# Altium project cSLIM-shield.PrjPcb (part 2 of 2)

## Sheet cSLIM-SA_GPS.SchDoc: cSLIM v1 - GNSS
size A4; SheetNumber: 10; SheetTotal: 12
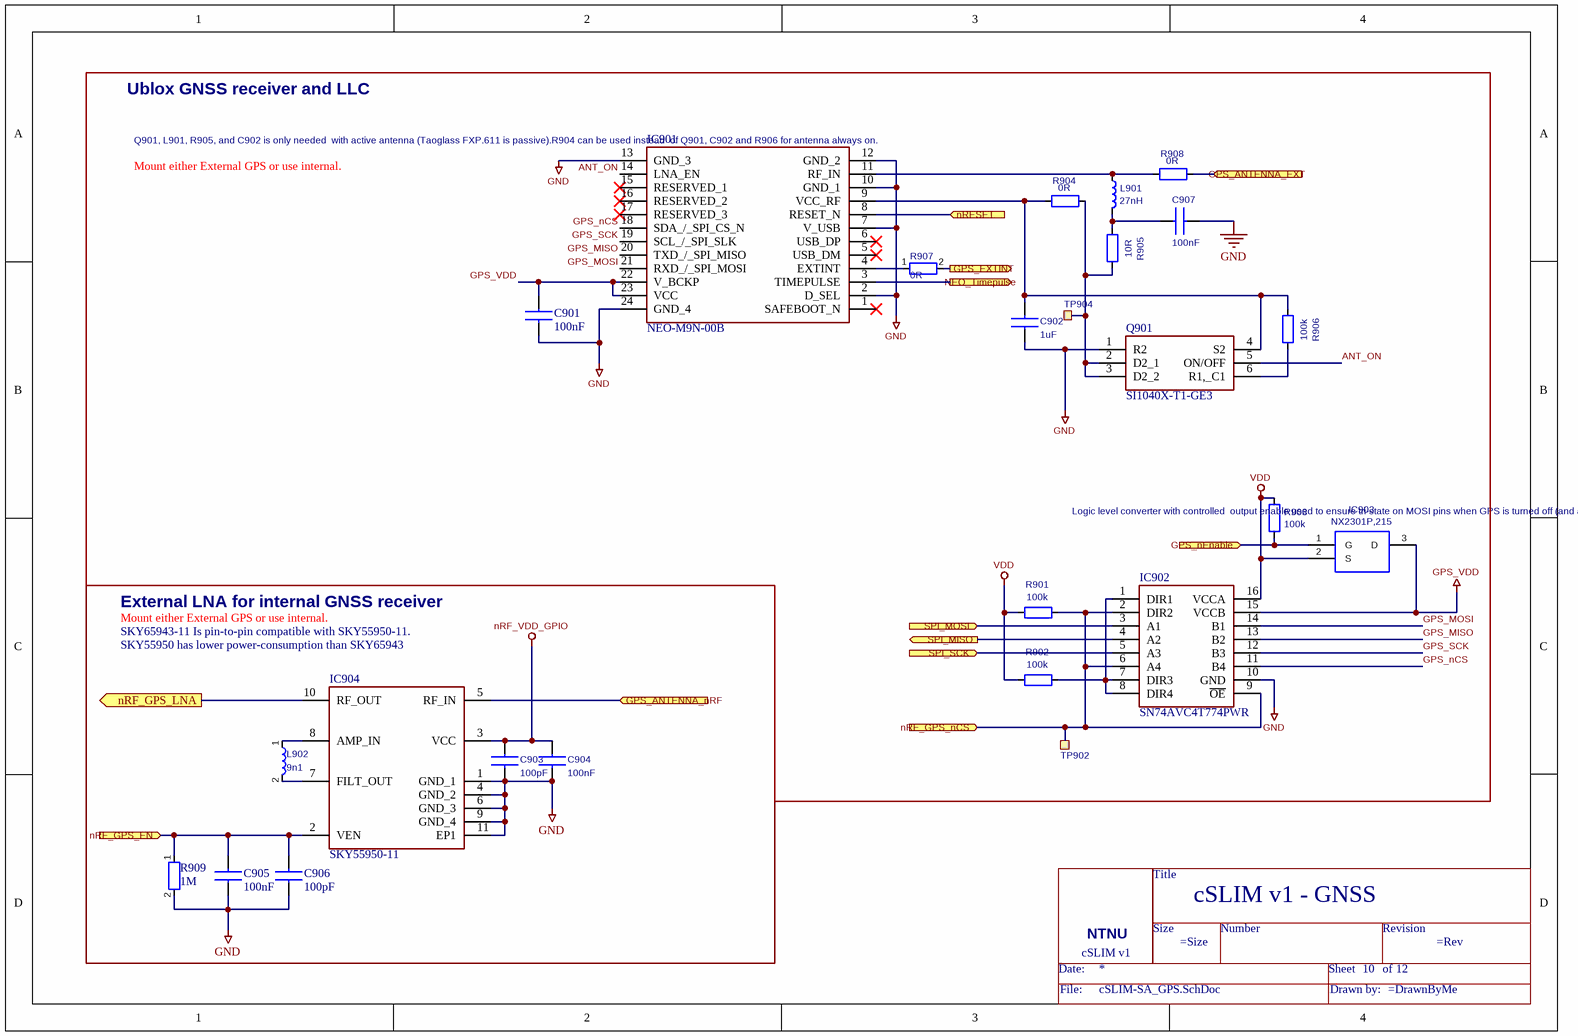
[diagram p8: cSLIM-SA_GPS.SchDoc]

### Parts
(Parts that share a designator on the sheet are numbered #1, #2 ... from top to bottom, then left to right.)
=DocumentName#3  Title_block  (value not drawn)  (no BOM)
C901  100nF  [CAPC1608X90N]
C902  1uF  [CAPC1608X90N]
C903  100pF  [CAPC1608X90N]
C904  100nF  [CAPC1608X90N]
C905  100nF  [CAPC1608X90N]
C906  100pF  [CAPC1608X90N]
C907  100nF  [CAPC1608X90N]
IC901  NEO-M9N-00B  [NEOM9N00B]
IC902  SN74AVC4T774PWR  [SOP65P640X120-16N]
IC903  NX2301P,215  [SOT95P230X110-3N]
IC904  SKY55950-11  [SKY6594311]
L901  27nH  [L-1608]
L902  9n1  [LQW18AS10NG0CD]
Q901  SI1040X-T1-GE3  [SOTFL50P160X60-6N]
R901  100k  [RESC1608X55N]
R902  100k  [RESC1608X55N]
R903  100k  [RESC1608X55N]
R904  0R  [RESC1608X55N]
R905  10R  [RESC1608X55N]
R906  100k  [RESC1608X55N]
R907  0R  [RESC1608X55N]
R908  0R  [RESC1608X55N]
R909  1M  [RESC1608X55N]
TP902  (no value)  [TP_SMD_Ø1.0mm]  (no BOM)
TP904  (no value)  [TP_SMD_Ø1.0mm]  (no BOM)

### Blocks framed on the sheet
Ublox GNSS receiver and LLC: C901 C902 C907 IC901-IC903 L901 Q901 R901-R908 TP902 TP904
External LNA for internal GNSS receiver: C903-C906 IC904 L902 R909

### Ports
GPS_ANTENNA_EXT (in), GPS_ANTENNA_nRF (in), GPS_EXTINT (out), GPS_nEnable (in), NEO_Timepulse (out), nRESET (in), nRF_GPS_EN (in), nRF_GPS_LNA (out), nRF_GPS_nCS (in), SPI_MISO (out), SPI_MOSI (in), SPI_SCK (in)

### Nets
GND: C901.2 C902.2 C903.1 C904.1 C905.1 C906.1 C907.2 IC901.2(D_SEL) IC901.7(V_USB) IC901.10(GND_1) IC901.12(GND_2) IC901.13(GND_3) IC901.24(GND_4) IC902.10(GND) IC904.1(GND_1) IC904.4(GND_2) IC904.6(GND_3) IC904.9(GND_4) IC904.11(EP1) Q901.1(R2) R909.2
GPS_VDD: C901.1 IC901.22(V_BCKP) IC901.23(VCC) IC902.15(VCCB) IC903.3(D)
nRF_VDD_GPIO: C903.2 C904.2 IC904.3(VCC)
VDD: IC902.16(VCCA) IC903.2(S) R901.2 R902.2 R903.2
ANT_ON: IC901.14(LNA_EN) Q901.5(ON/OFF)
GPS_ANTENNA_EXT: R908.1 ; port GPS_ANTENNA_EXT
GPS_ANTENNA_nRF: IC904.5(RF_IN) ; port GPS_ANTENNA_nRF
GPS_EXTINT: R907.2 ; port GPS_EXTINT
GPS_MISO: IC901.20(TXD_/_SPI_MISO) IC902.13(B2)
GPS_MOSI: IC901.21(RXD_/_SPI_MOSI) IC902.14(B1)
GPS_nCS: IC901.18(SDA_/_SPI_CS_N) IC902.11(B4)
GPS_nEnable: IC903.1(G) R903.1 ; port GPS_nEnable
GPS_SCK: IC901.19(SCL_/_SPI_SLK) IC902.12(B3)
NEO_Timepulse: IC901.3(TIMEPULSE) ; port NEO_Timepulse
nRESET: IC901.8(RESET_N) ; port nRESET
nRF_GPS_EN: C905.2 C906.2 IC904.2(VEN) R909.1 ; port nRF_GPS_EN
nRF_GPS_LNA: IC904.10(RF_OUT) ; port nRF_GPS_LNA
nRF_GPS_nCS: IC902.2(DIR2) IC902.6(A4) IC902.9(~{OE}) R901.1 TP902.1 ; port nRF_GPS_nCS
SPI_MISO: IC902.4(A2) ; port SPI_MISO
SPI_MOSI: IC902.3(A1) ; port SPI_MOSI
SPI_SCK: IC902.5(A3) ; port SPI_SCK
NetC902_1: C902.1 IC901.9(VCC_RF) Q901.4(S2) R904.2 R906.2
NetC907_1: C907.1 L901.2 R905.2
NetIC901_4: IC901.4(EXTINT) R907.1
NetIC901_11: IC901.11(RF_IN) L901.1 R908.2
NetIC902_1: IC902.1(DIR1) IC902.7(DIR3) IC902.8(DIR4) R902.1
NetIC904_7: IC904.7(FILT_OUT) L902.2
NetIC904_8: IC904.8(AMP_IN) L902.1
NetQ901_2: Q901.2(D2_1) Q901.3(D2_2) R904.1 R905.1 TP904.1
NetQ901_6: Q901.6(R1,_C1) R906.1

Not connected (* = marked no-connect by the designer): IC901 1(SAFEBOOT_N)* 5(USB_DM)* 6(USB_DP)* 15(RESERVED_1)* 16(RESERVED_2)* 17(RESERVED_3)*

### Notes on the sheet
- (near IC901) Q901, L901, R905, and C902 is only needed
  with active antenna (Taoglass FXP.611 is passive).R904 can be used instead
  of Q901, C902 and R906 for antenna always on.
- Mount either External GPS or use internal.
- (near R903) Logic level converter with controlled
  output enable used to ensure tri-state
  on MOSI pins when GPS is turned off
  (and avoid waking up GPS on activity
  on MOSI line as describe by Rundhovde)
- SKY65943-11 Is pin-to-pin compatible with SKY55950-11.
- (near IC904) SKY55950 has lower power-consumption than SKY65943
- 1
- 2
- 3
- 4
- 5
- 6
- A
- B
- C
- Eivind Jølsgard
- D
- Title: cSLIM External GPS
- File: cSLIM_GPS.sch
- Sheet: /
- NTNU
- KiCad E.D.A.  kicad (5.1.4)-1
- Size: A4
- Date: 2021-03-31
- Rev: v1
- Id: 9/11
- (in symbol Title_block) Title; Size; Number; Revision; NTNU; cSLIM v1; Date:; Sheet; of; File:; Drawn by:

### Library data of the parts
C901-C907 = C: Capacitor; Manufacturer_Name: AVX; Manufacturer_Part_Number: 06033G104ZAT2A; Datasheet Link: http://www.mouser.com/catalog/supplier/library/pdf/AVXSurfaceMountCeramic.pdf; Height: 0.9mm; Mouser Part Number: 581-06033G104Z; Mouser Price/Stock: https://www.mouser.co.uk/ProductDetail/AVX/06033G104ZAT2A?qs=NXubJDmysXJMPmHfVo6Z%252BA%3D%3D; Arrow Part Number: 06033G104ZAT2A; Arrow Price/Stock: https://www.arrow.com/en/products/06033g104zat2a/avx?region=nac
IC901 = NEO-M9N-00B: Integrated Circuit; Manufacturer_Name: U-Blox; Datasheet Link: https://www.u-blox.com/sites/default/files/NEO-M9N_DataSheet_%28UBX-19014285%29.pdf; Height: 2.6mm; Manufacturer_Part_Number: NEO-M9N-00B; Mouser Part Number: 377-NEO-M9N-00B; Mouser Price/Stock: https://www.mouser.co.uk/ProductDetail/u-blox/NEO-M9N-00B?qs=DPoM0jnrROVeJ6BHpcwcjw%3D%3D
IC902 = SN74AVC4T774PWR: Integrated Circuit; Manufacturer_Name: Texas Instruments; Datasheet Link: http://www.ti.com/lit/gpn/sn74avc4t774; Height: 1.2mm; Manufacturer_Part_Number: SN74AVC4T774PWR; Mouser Part Number: 595-SN74AVC4T774PWR; Mouser Price/Stock: https://www.mouser.co.uk/ProductDetail/Texas-Instruments/SN74AVC4T774PWR?qs=WxL8HmPi5r562Eu%2F2kE2LA%3D%3D; Arrow Part Number: SN74AVC4T774PWR; Arrow Price/Stock: https://www.arrow.com/en/products/sn74avc4t774pwr/texas-instruments?region=nac
IC903 = NX2301P,215: Manufacturer_Name: Nexperia; Height: 1.1; Mouser Part Number: 771-NX2301P215; Mouser Price/Stock: https://www.mouser.co.uk/ProductDetail/Nexperia/NX2301P215?qs=A1cBxND5mHKs%252BLrxCDENxw%3D%3D; Manufacturer_Part_Number: NX2301P,215; Value: NX2301P,215; Footprint: SamacSys:SOT95P230X110-3N
IC904 = SKY65943-11: Integrated Circuit; Manufacturer_Name: Skyworks; Datasheet Link: https://datasheet.datasheetarchive.com/originals/distributors/DKDS41/DSANUWW0028396.pdf; Height: 0.7mm; Manufacturer_Part_Number: SKY65943-11; Mouser Part Number: 873-SKY65943-11; Mouser Price/Stock: https://www.mouser.co.uk/ProductDetail/Skyworks-Solutions-Inc/SKY65943-11?qs=w%2Fv1CP2dgqpnHmrnB1Mkow%3D%3D
L901 = L
L902 = L_1
Q901 = SI1040X-T1-GE3: MOSFET (N-Channel); Manufacturer_Name: Vishay; Datasheet Link: https://www.vishay.com/docs/71809/si1040x.pdf; Height: 0.6mm; Manufacturer_Part_Number: SI1040X-T1-GE3; Mouser Part Number: 781-SI1040X-T1-GE3; Mouser Price/Stock: https://www.mouser.co.uk/ProductDetail/Vishay-Semiconductors/SI1040X-T1-GE3?qs=tWM4QuTcS4WRJw%2FdSgdX6Q%3D%3D; Arrow Part Number: SI1040X-T1-GE3; Arrow Price/Stock: https://www.arrow.com/en/products/si1040x-t1-ge3/vishay
R901-R909 = R
  R901-R903 R906: Value: 100k
  R904 R908: Value: 0R
  R905: Value: 10R
TP902 TP904 = TP

## Sheet cSLIM-SA_FRAM.SchDoc
size 297 x 210 mm; SheetNumber: 11
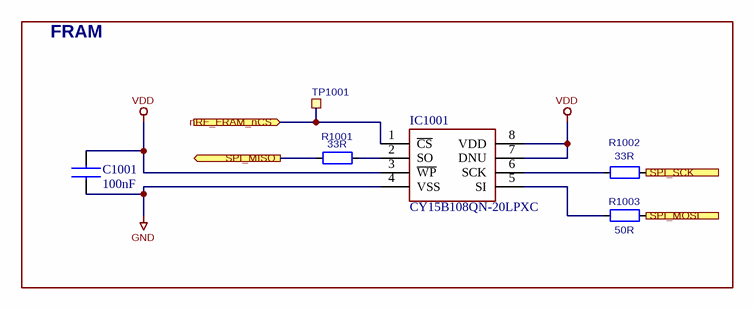
[diagram p9: cSLIM-SA_FRAM.SchDoc]

### Parts
C1001  100nF  [CAPC1608X90N]
IC1001  CY15B108QN-20LPXC  [SON65P323X328X55-8N]
R1001  33R  [RESC1608X55N]
R1002  33R  [RESC1608X55N]
R1003  50R  [RESC1608X55N]
TP1001  (no value)  [TP_SMD_Ø1.0mm]  (no BOM)

### Blocks framed on the sheet
FRAM: C1001 IC1001 R1001-R1003 TP1001

### Ports
nRF_FRAM_nCS (in), SPI_MISO (out), SPI_MOSI (in), SPI_SCK (in)

### Nets
GND: C1001.2 IC1001.4(VSS)
VDD: C1001.1 IC1001.3(~{WP}) IC1001.7(DNU) IC1001.8(VDD)
nRF_FRAM_nCS: IC1001.1(~{CS}) TP1001.1 ; port nRF_FRAM_nCS
SPI_MISO: R1001.1 ; port SPI_MISO
SPI_MOSI: R1003.1 ; port SPI_MOSI
SPI_SCK: R1002.1 ; port SPI_SCK
NetIC1001_2: IC1001.2(SO) R1001.2
NetIC1001_5: IC1001.5(SI) R1003.2
NetIC1001_6: IC1001.6(SCK) R1002.2

### Notes on the sheet
- 1
- 2
- 3
- 4
- 5
- 6
- A
- B
- C
- Eivind Jølsgard
- D
- Title: cSLIM FRAM
- File: cSLIM_FRAM.sch
- Sheet: /
- NTNU
- KiCad E.D.A.  kicad (5.1.4)-1
- Size: A4
- Date: 2021-03-31
- Rev: v1
- Id: 10/11

### Library data of the parts
C1001 = C: as C901 on sheet cSLIM-SA_GPS; Datasheet Link: http://www.mouser.com/catalog/supplier/library/pdf/AVXSurfaceMountCeramic.pdf; Height: 0.9mm; Mouser Part Number: 581-06033G104Z; Mouser Price/Stock: https://www.mouser.co.uk/ProductDetail/AVX/06033G104ZAT2A?qs=NXubJDmysXJMPmHfVo6Z%252BA%3D%3D; Arrow Part Number: 06033G104ZAT2A; Arrow Price/Stock: https://www.arrow.com/en/products/06033g104zat2a/avx?region=nac
IC1001 = CY15B108QN-20LPXC: Integrated Circuit; Manufacturer_Name: Cypress Semiconductor; Datasheet Link: https://www.arrow.com/en/products/cy15b108qn-20lpxc/cypress-semiconductor; Height: 0.55mm; Manufacturer_Part_Number: CY15B108QN-20LPXC; Mouser Part Number: 727-CY15B108QN20LPXC; Mouser Price/Stock: https://www.mouser.co.uk/ProductDetail/Cypress-Semiconductor/CY15B108QN-20LPXC?qs=P1JMDcb91o5srFPNWUxrEA%3D%3D; Arrow Part Number: CY15B108QN-20LPXC; Arrow Price/Stock: https://www.arrow.com/en/products/cy15b108qn-20lpxc/cypress-semiconductor?region=nac
R1001-R1003 = R
  R1001 R1002: Value: 33R
  R1003: Value: 50R
TP1001 = TP

## Sheet cSLIM-SA_RTC.SchDoc: cSLIM v1 - RTC
size A4; SheetNumber: 12; SheetTotal: 12
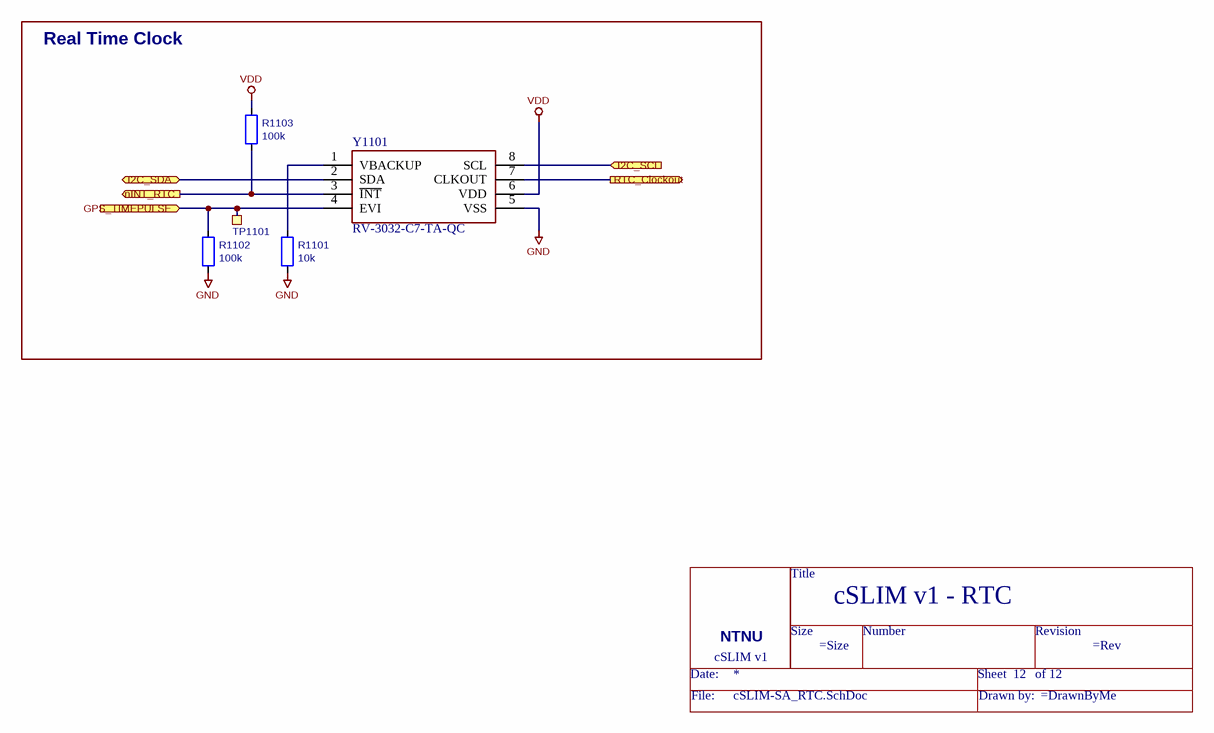
[diagram p10: cSLIM-SA_RTC.SchDoc]

### Parts
(Parts that share a designator on the sheet are numbered #1, #2 ... from top to bottom, then left to right.)
=DocumentName#4  Title_block  (value not drawn)  (no BOM)
R1101  10k  [RESC1608X55N]
R1102  100k  [RESC1608X55N]
R1103  100k  [RESC1608X55N]
TP1101  (no value)  [TP_SMD_Ø1.0mm]  (no BOM)
Y1101  RV-3032-C7-TA-QC  [RV3032C7TAQA]

### Blocks framed on the sheet
Real Time Clock: R1101-R1103 TP1101 Y1101

### Ports
GPS_TIMEPULSE (in), I2C_SCL (in), I2C_SDA (bidir), nINT_RTC (out), RTC_Clockout (out)

### Nets
GND: R1101.2 R1102.1 Y1101.5(VSS)
VDD: R1103.2 Y1101.6(VDD)
GPS_TIMEPULSE: R1102.2 TP1101.1 Y1101.4(EVI) ; port GPS_TIMEPULSE
I2C_SCL: Y1101.8(SCL) ; port I2C_SCL
I2C_SDA: Y1101.2(SDA) ; port I2C_SDA
nINT_RTC: R1103.1 Y1101.3(~{INT}) ; port nINT_RTC
RTC_Clockout: Y1101.7(CLKOUT) ; port RTC_Clockout
NetR1101_1: R1101.1 Y1101.1(VBACKUP)

### Notes on the sheet
- 1
- 2
- 3
- 4
- 5
- 6
- A
- B
- C
- Eivind Jølsgard
- D
- Title: cSLIM RTC
- File: cSLIM_RTC.sch
- Sheet: /
- NTNU
- KiCad E.D.A.  kicad (5.1.4)-1
- Size: A4
- Date: 2021-03-31
- Rev: v1
- Id: 11/11
- (in symbol Title_block) Title; Size; Number; Revision; NTNU; cSLIM v1; Date:; Sheet; of; File:; Drawn by:

### Library data of the parts
R1101-R1103 = R
  R1101: Value: 10k
  R1102 R1103: Value: 100k
TP1101 = TP
Y1101 = RV-3032-C7-TA-QC: Integrated Circuit; Manufacturer_Name: Micro Crystal AG; Datasheet Link: https://www.microcrystal.com/fileadmin/Media/Products/RTC/Datasheet/RV-3032-C7.pdf; Height: 0.8mm; Manufacturer_Part_Number: RV-3032-C7-TA-QC

## Sheet cSLIM-SA_nRF9160.SchDoc: cSLIM v1 - nRF9160
size A3; SheetNumber: 2; SheetTotal: 12; Size: A3
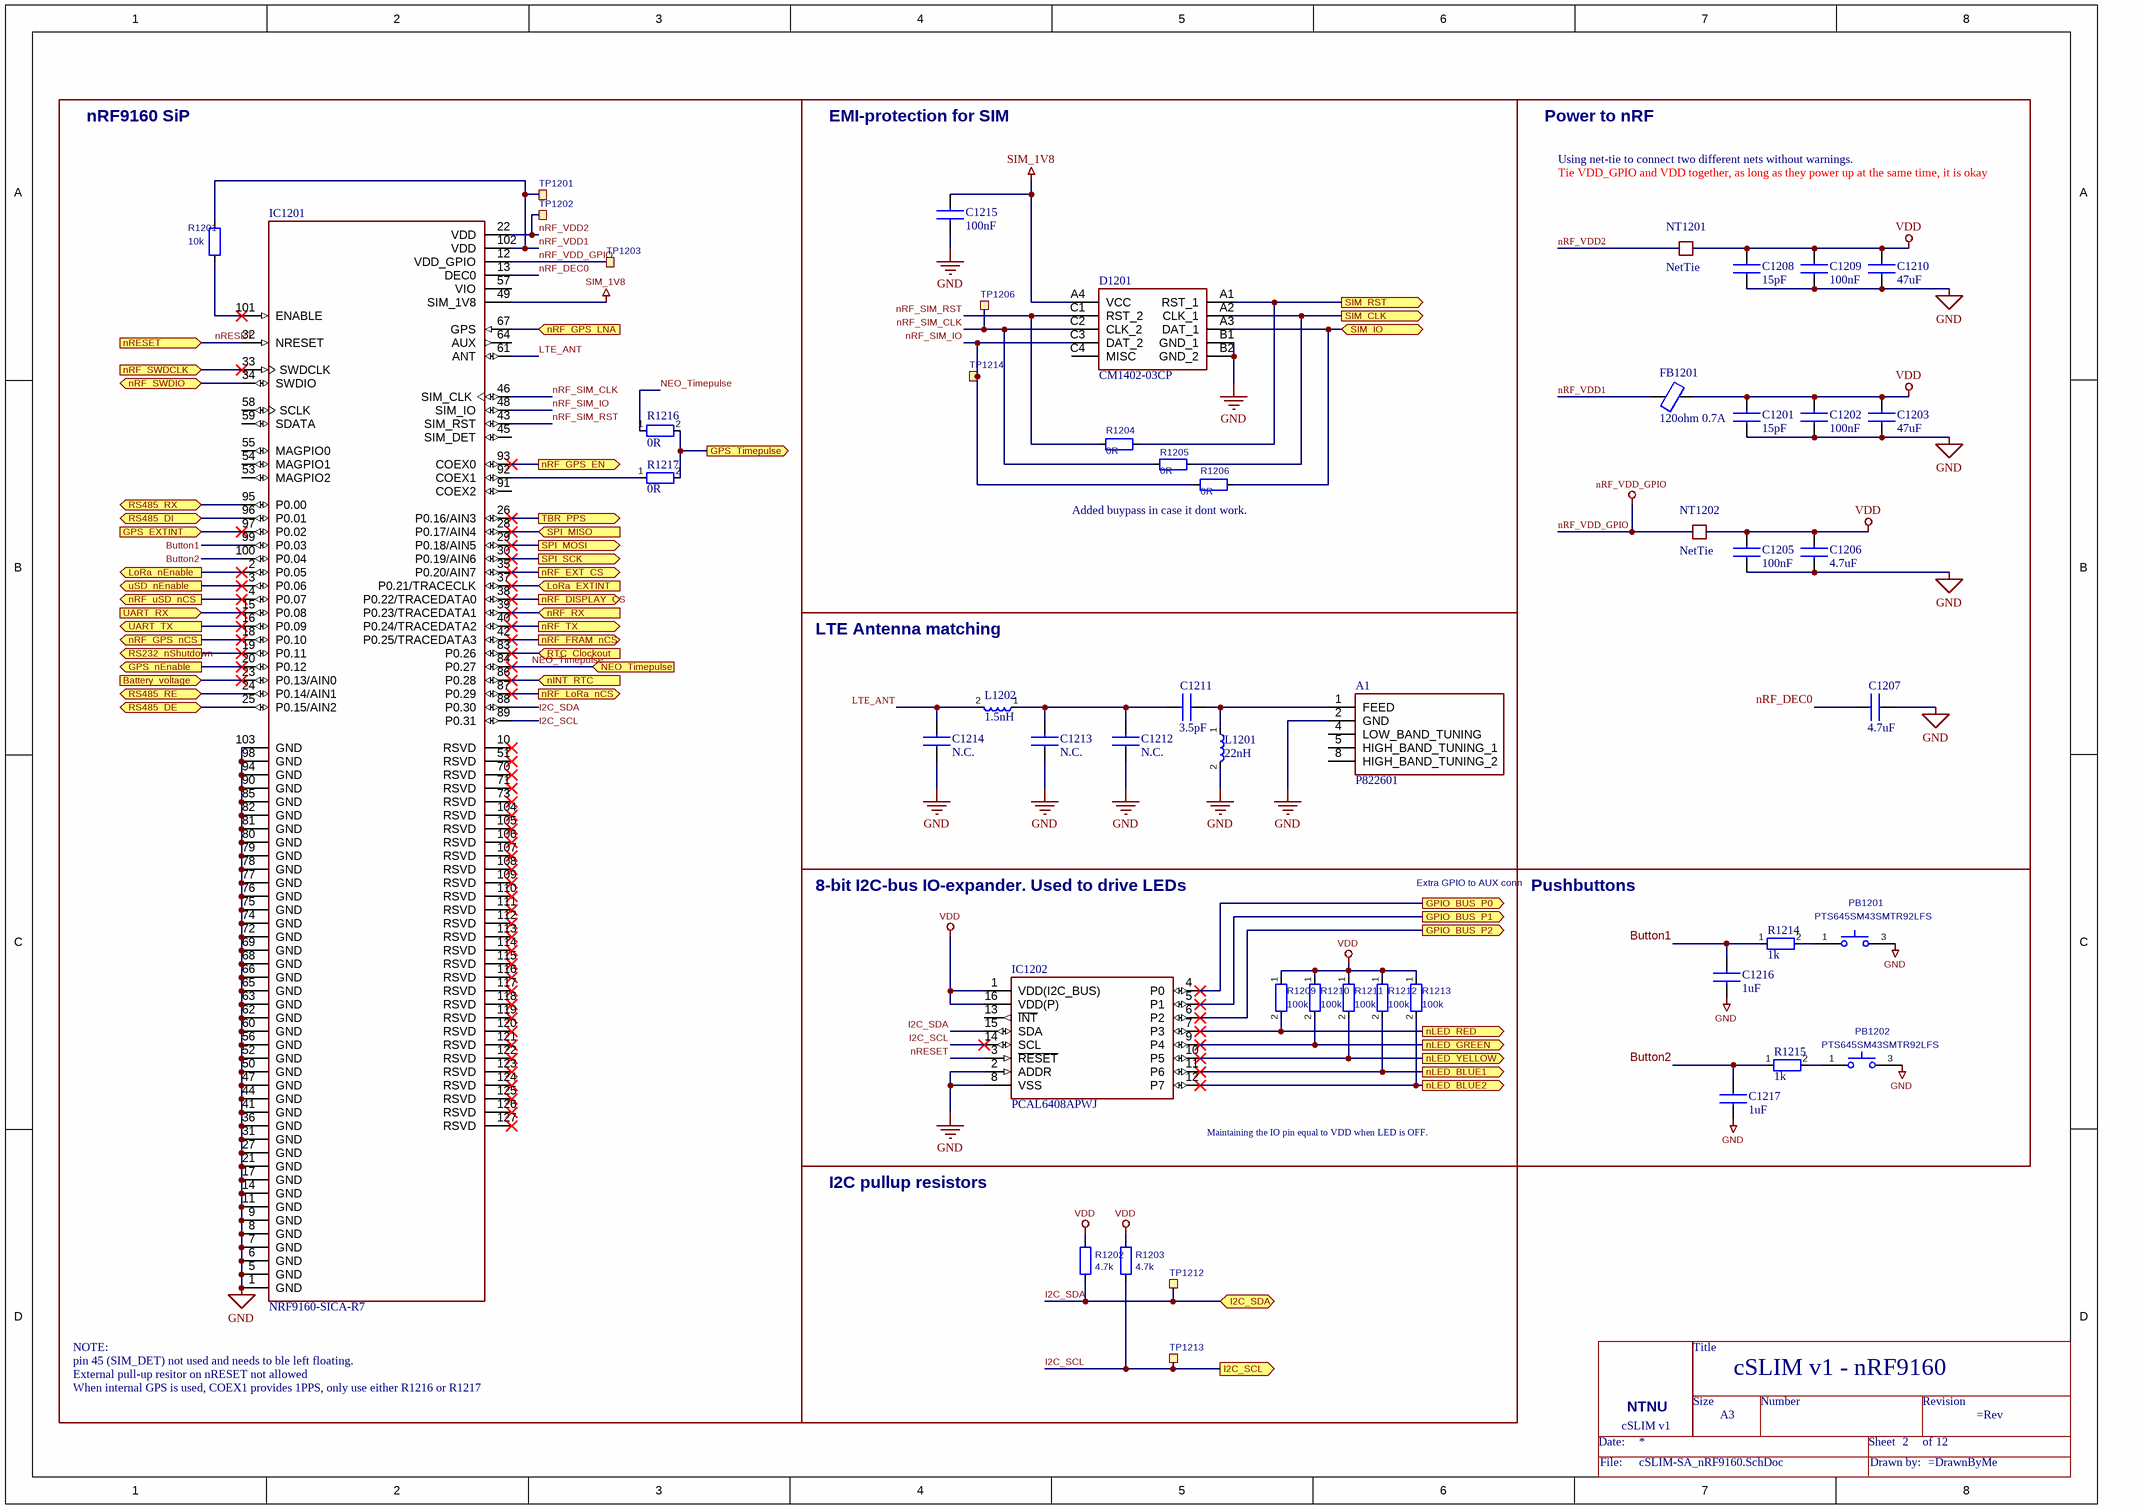
[diagram p11: cSLIM-SA_nRF9160.SchDoc]

### Parts
(Parts that share a designator on the sheet are numbered #1, #2 ... from top to bottom, then left to right.)
=DocumentName#5  Title_block  (value not drawn)  (no BOM)
A1  P822601  [P822601]
C1201  15pF  [CAPC1608X90N]
C1202  100nF  [CAPC1608X90N]
C1203  47uF  [CAPC1608X90N]
C1205  100nF  [CAPC1608X90N]
C1206  4.7uF  [CAPC1608X90N]
C1207  4.7uF  [CAPC1608X90N]
C1208  15pF  [CAPC1608X90N]
C1209  100nF  [CAPC1608X90N]
C1210  47uF  [CAPC1608X90N]
C1211  3.5pF  [CAPC1608X90N]
C1212  N.C.  [CAPC1608X90N]
C1213  N.C.  [CAPC1608X90N]
C1214  N.C.  [CAPC1608X90N]
C1215  100nF  [CAPC1608X90N]
C1216  1uF  [CAPC1608X90N]
C1217  1uF  [CAPC1608X90N]
D1201  CM1402-03CP  [CM140203CP]
FB1201  120ohm 0.7A  [CAPC1608X90N]
IC1201  NRF9160-SICA-R7  [XCVR_NRF9160-SICA-R7]
IC1202  PCAL6408APWJ  [SOP65P640X110-16N]
L1201  22nH  [L-1608]
L1202  1.5nH  [L-1608]
NT1201  NetTie  [NETTIE_FP]
NT1202  NetTie  [NETTIE_FP]
PB1201  value PTS645SM43SMTR92LFS  [PTS645(SMT)]
PB1202  value PTS645SM43SMTR92LFS  [PTS645(SMT)]
R1201  10k  [RESC1608X55N]
R1202  4.7k  [RESC1608X55N]
R1203  4.7k  [RESC1608X55N]
R1204  0R  [RESC1608X55N]
R1205  0R  [RESC1608X55N]
R1206  0R  [RESC1608X55N]
R1209  100k  [RESC1608X55N]
R1210  100k  [RESC1608X55N]
R1211  100k  [RESC1608X55N]
R1212  100k  [RESC1608X55N]
R1213  100k  [RESC1608X55N]
R1214  1k  [RESC1608X55N]
R1215  1k  [RESC1608X55N]
R1216  0R  [RESC1608X55N]
R1217  0R  [RESC1608X55N]
TP1201  (no value)  [TP_SMD_Ø1.0mm]  (no BOM)
TP1202  (no value)  [TP_SMD_Ø1.0mm]  (no BOM)
TP1203  (no value)  [TP_SMD_Ø1.0mm]  (no BOM)
TP1206  (no value)  [TP_SMD_Ø1.0mm]  (no BOM)
TP1212  (no value)  [TP_SMD_Ø1.0mm]  (no BOM)
TP1213  (no value)  [TP_SMD_Ø1.0mm]  (no BOM)
TP1214  (no value)  [TP_SMD_Ø1.0mm]  (no BOM)

### Blocks framed on the sheet
nRF9160 SiP: IC1201 R1201 R1216 R1217 TP1201-TP1203
EMI-protection for SIM: C1215 D1201 R1204-R1206 TP1206 TP1214
Power to nRF: C1201-C1203 C1205-C1210 FB1201 NT1201 NT1202
LTE Antenna matching: A1 C1211-C1214 L1201 L1202
8-bit I2C-bus IO-expander. Used to drive LEDs: IC1202 R1209-R1213
Pushbuttons: C1216 C1217 PB1201 PB1202 R1214 R1215
I2C pullup resistors: R1202 R1203 TP1212 TP1213

### Ports
Battery_voltage (in), GPIO_BUS_P0 (out), GPIO_BUS_P1 (out), GPIO_BUS_P2 (out), GPS_EXTINT (in), GPS_nEnable (out), GPS_Timepulse (out), I2C_SCL (out), I2C_SDA (bidir), LoRa_EXTINT (in), LoRa_nEnable (out), NEO_Timepulse (in), nINT_RTC (in), nLED_BLUE1 (out), nLED_BLUE2 (out), nLED_GREEN (out), nLED_RED (out), nLED_YELLOW (out), nRESET (in), nRF_DISPLAY_CS (out), nRF_EXT_CS (out), nRF_FRAM_nCS (out), nRF_GPS_EN (out), nRF_GPS_LNA (in), nRF_GPS_nCS (out), nRF_LoRa_nCS (out), nRF_RX (in), nRF_SWDCLK (in), nRF_SWDIO (bidir), nRF_TX (out), nRF_uSD_nCS (out), RS232_nShutdown (out), RS485_DE (bidir), RS485_DI (bidir), RS485_RE (bidir), RS485_RX (bidir), RTC_Clockout (in), SIM_CLK (out), SIM_IO (bidir), SIM_RST (out), SPI_MISO (in), SPI_MOSI (out), SPI_SCK (out), TBR_PPS (out), UART_RX (in), UART_TX (out), uSD_nEnable (out)

### Nets
GND: A1.2(GND) C1201.2 C1202.2 C1203.2 C1205.2 C1206.2 C1207.2 C1208.2 C1209.2 C1210.2 C1212.2 C1213.2 C1214.2 C1215.2 C1216.2 C1217.2 D1201.B1(GND_1) D1201.B2(GND_2) IC1201.1(GND) IC1201.5(GND) IC1201.6(GND) IC1201.7(GND) IC1201.8(GND) IC1201.9(GND) IC1201.11(GND) IC1201.14(GND) IC1201.17(GND) IC1201.21(GND) IC1201.27(GND) IC1201.31(GND) IC1201.36(GND) IC1201.41(GND) IC1201.44(GND) IC1201.47(GND) IC1201.50(GND) IC1201.52(GND) IC1201.56(GND) IC1201.60(GND) IC1201.62(GND) IC1201.63(GND) IC1201.65(GND) IC1201.66(GND) IC1201.68(GND) IC1201.69(GND) IC1201.72(GND) IC1201.74(GND) IC1201.75(GND) IC1201.76(GND) IC1201.77(GND) IC1201.78(GND) IC1201.79(GND) IC1201.80(GND) IC1201.81(GND) IC1201.82(GND) IC1201.85(GND) IC1201.90(GND) IC1201.94(GND) IC1201.98(GND) IC1201.103(GND) IC1202.2(ADDR) IC1202.8(VSS) L1201.2 PB1201.3 PB1202.3
nRF_VDD_GPIO: IC1201.12(VDD_GPIO) NT1202.1 TP1203.1
SIM_1V8: C1215.1 D1201.A4(VCC) IC1201.49(SIM_1V8)
VDD: C1201.1 C1202.1 C1203.1 C1205.1 C1206.1 C1208.1 C1209.1 C1210.1 FB1201.2 IC1202.1(VDD(I2C_BUS)) IC1202.16(VDD(P)) NT1201.2 NT1202.2 R1202.2 R1203.2 R1209.1 R1210.1 R1211.1 R1212.1 R1213.1
Battery_voltage: IC1201.23(P0.13/AIN0) ; port Battery_voltage
Button1: C1216.1 IC1201.99(P0.03) R1214.1
Button2: C1217.1 IC1201.100(P0.04) R1215.1
GPIO_BUS_P0: IC1202.4(P0) ; port GPIO_BUS_P0
GPIO_BUS_P1: IC1202.5(P1) ; port GPIO_BUS_P1
GPIO_BUS_P2: IC1202.6(P2) ; port GPIO_BUS_P2
GPS_EXTINT: IC1201.97(P0.02) ; port GPS_EXTINT
GPS_nEnable: IC1201.20(P0.12) ; port GPS_nEnable
GPS_TIMEPULSE: R1216.2 R1217.2 ; port GPS_Timepulse
I2C_SCL: IC1201.89(P0.31) IC1202.14(SCL) R1203.1 TP1213.1 ; port I2C_SCL
I2C_SDA: IC1201.88(P0.30) IC1202.15(SDA) R1202.1 TP1212.1 ; port I2C_SDA
LoRa_EXTINT: IC1201.37(P0.21/TRACECLK) ; port LoRa_EXTINT
LoRa_nEnable: IC1201.2(P0.05) ; port LoRa_nEnable
LTE_ANT: C1214.1 IC1201.61(ANT) L1202.2
NEO_Timepulse: IC1201.84(P0.27) R1216.1 ; port NEO_Timepulse
nINT_RTC: IC1201.86(P0.28) ; port nINT_RTC
nLED_BLUE1: IC1202.11(P6) R1212.2 ; port nLED_BLUE1
nLED_BLUE2: IC1202.12(P7) R1213.2 ; port nLED_BLUE2
nLED_GREEN: IC1202.9(P4) R1210.2 ; port nLED_GREEN
nLED_RED: IC1202.7(P3) R1209.2 ; port nLED_RED
nLED_YELLOW: IC1202.10(P5) R1211.2 ; port nLED_YELLOW
nRESET: IC1201.32(NRESET) IC1202.3(~{RESET}) ; port nRESET
nRF_DEC0: C1207.1 IC1201.13(DEC0)
nRF_DISPLAY_CS: IC1201.38(P0.22/TRACEDATA0) ; port nRF_DISPLAY_CS
nRF_EXT_CS: IC1201.35(P0.20/AIN7) ; port nRF_EXT_CS
nRF_FRAM_nCS: IC1201.42(P0.25/TRACEDATA3) ; port nRF_FRAM_nCS
nRF_GPS_EN: IC1201.93(COEX0) ; port nRF_GPS_EN
nRF_GPS_LNA: IC1201.67(GPS) ; port nRF_GPS_LNA
nRF_GPS_nCS: IC1201.18(P0.10) ; port nRF_GPS_nCS
nRF_LoRa_nCS: IC1201.87(P0.29) ; port nRF_LoRa_nCS
nRF_RX: IC1201.39(P0.23/TRACEDATA1) ; port nRF_RX
nRF_SIM_CLK: D1201.C2(CLK_2) IC1201.46(SIM_CLK) R1205.1 TP1206.1
nRF_SIM_IO: D1201.C3(DAT_2) IC1201.48(SIM_IO) R1206.1 TP1214.1
nRF_SIM_RST: D1201.C1(RST_2) IC1201.43(SIM_RST) R1204.1
nRF_SWDCLK: IC1201.33(SWDCLK) ; port nRF_SWDCLK
nRF_SWDIO: IC1201.34(SWDIO) ; port nRF_SWDIO
nRF_TX: IC1201.40(P0.24/TRACEDATA2) ; port nRF_TX
nRF_uSD_nCS: IC1201.4(P0.07) ; port nRF_uSD_nCS
nRF_VDD1: FB1201.1 IC1201.102(VDD) R1201.1 TP1201.1
nRF_VDD2: IC1201.22(VDD) NT1201.1 TP1202.1
RS232_nShutdown: IC1201.19(P0.11) ; port RS232_nShutdown
RS485_DE: IC1201.25(P0.15/AIN2) ; port RS485_DE
RS485_DI: IC1201.96(P0.01) ; port RS485_DI
RS485_RE: IC1201.24(P0.14/AIN1) ; port RS485_RE
RS485_RX: IC1201.95(P0.00) ; port RS485_RX
RTC_Clockout: IC1201.83(P0.26) ; port RTC_Clockout
SIM_CLK: D1201.A2(CLK_1) R1205.2 ; port SIM_CLK
SIM_IO: D1201.A3(DAT_1) R1206.2 ; port SIM_IO
SIM_RST: D1201.A1(RST_1) R1204.2 ; port SIM_RST
SPI_MISO: IC1201.28(P0.17/AIN4) ; port SPI_MISO
SPI_MOSI: IC1201.29(P0.18/AIN5) ; port SPI_MOSI
SPI_SCK: IC1201.30(P0.19/AIN6) ; port SPI_SCK
TBR_PPS: IC1201.26(P0.16/AIN3) ; port TBR_PPS
UART_RX: IC1201.15(P0.08) ; port UART_RX
UART_TX: IC1201.16(P0.09) ; port UART_TX
uSD_nEnable: IC1201.3(P0.06) ; port uSD_nEnable
NetA1_1: A1.1(FEED) C1211.2 L1201.1
NetC1211_1: C1211.1 C1212.1 C1213.1 L1202.1
NetIC1201_92: IC1201.92(COEX1) R1217.1
NetIC1201_101: IC1201.101(ENABLE) R1201.2
NetPB1201_1: PB1201.1 R1214.2
NetPB1202_1: PB1202.1 R1215.2

Not connected (* = marked no-connect by the designer): A1 4(LOW_BAND_TUNING) 5(HIGH_BAND_TUNING_1) 8(HIGH_BAND_TUNING_2); D1201 C4(MISC); IC1201 10(RSVD)* 45(SIM_DET) 51(RSVD)* 53(MAGPIO2) 54(MAGPIO1) 55(MAGPIO0) 57(VIO) 58(SCLK) 59(SDATA) 64(AUX) 70(RSVD)* 71(RSVD)* 73(RSVD)* 91(COEX2) 104(RSVD)* 105(RSVD)* 106(RSVD)* 107(RSVD)* 108(RSVD)* 109(RSVD)* 110(RSVD)* 111(RSVD)* 112(RSVD)* 113(RSVD)* 114(RSVD)* 115(RSVD)* 116(RSVD)* 117(RSVD)* 118(RSVD)* 119(RSVD)* 120(RSVD)* 121(RSVD)* 122(RSVD)* 123(RSVD)* 124(RSVD)* 125(RSVD)* 126(RSVD)* 127(RSVD)*; IC1202 13(~{INT})

### Notes on the sheet
- Tie VDD_GPIO and VDD together, as long as they power up at the same time, it is okay
- Using net-tie to connect two different nets without warnings.
- (near R1206) Added buypass in case it dont work.
- Extra GPIO to AUX conn
- Maintaining the IO pin equal to VDD when LED is OFF.
- NOTE:
- pin 45 (SIM_DET) not used and needs to ble left floating.
- External pull-up resitor on nRESET not allowed
- When internal GPS is used, COEX1 provides 1PPS, only use either R1216 or R1217
- THIS DOCUMENT AND THE DATA DISCLOSED HEREIN OR
- HEREWITH IS THE PROPERTY OF ALTIUM LIMITED AND MAY
- DWG NO:
- REVISION
- REV:
- DESCRIPTION
- DATE
- APPROVED
- BE FREELY DISTRIBUTED IN WHOLE. NO RIGHTS ARE
- RESERVED OR EXPRESS OR IMPLIED WARANTEE GIVEN.
- ENG:
- APPROVALS
- PROJECT
- DSN:
- CHK:
- REFERENCE DOCUMENTS
- PROJECT REVISION:
- TITLE
- DOCUMENT REVISION:
- DESIGN ITEM:
- BOM:
- FAB DWG:
- PCB DWG:
- ASSY DWG:
- SCALE:
- A3
- SIZE
- CAGE CODE
- FILE NAME
- DWG NO.
- SHEET
- OF
- REV
- (in symbol Title_block) Title; Size; Number; Revision; NTNU; cSLIM v1; Date:; Sheet; of; File:; Drawn by:

### Library data of the parts
A1 = P822601: Antenna; Manufacturer_Name: AVX; Datasheet Link: http://datasheets.avx.com/ethertronics/AVX-E_P822601-P822602.pdf; Height: 3.5mm; Manufacturer_Part_Number: P822601; Mouser Part Number: 581-P822601; Mouser Price/Stock: https://www.mouser.co.uk/ProductDetail/AVX/P822601?qs=vdi0iO8H4N0igrTLYxGIXg%3D%3D; Arrow Part Number: P822601; Arrow Price/Stock: https://www.arrow.com/en/products/p822601/avx?region=nac
C1201-C1203 C1205-C1217 = C: as C901 on sheet cSLIM-SA_GPS; Datasheet Link: http://www.mouser.com/catalog/supplier/library/pdf/AVXSurfaceMountCeramic.pdf; Height: 0.9mm; Mouser Part Number: 581-06033G104Z; Mouser Price/Stock: https://www.mouser.co.uk/ProductDetail/AVX/06033G104ZAT2A?qs=NXubJDmysXJMPmHfVo6Z%252BA%3D%3D; Arrow Part Number: 06033G104ZAT2A; Arrow Price/Stock: https://www.arrow.com/en/products/06033g104zat2a/avx?region=nac
D1201 = CM1402-03CP: Diode ESD (Uni-directional); Manufacturer_Name: ON Semiconductor; Datasheet Link: https://www.onsemi.com/pub/Collateral/CM1402-D.PDF; Height: 0.72mm; Manufacturer_Part_Number: CM1402-03CP; Mouser Part Number: 748-CM1402-03CP; Mouser Price/Stock: https://www.mouser.co.uk/ProductDetail/onsemi/CM1402-03CP?qs=lLuKAerq7nnG203YjtyI%252BA%3D%3D; Arrow Part Number: CM1402-03CP; Arrow Price/Stock: https://www.arrow.com/en/products/cm1402-03cp/on-semiconductor
FB1201 = Ferrite_Bead
IC1201 = NRF9160-SICA-R7: IC RF TxRx + MCU Cellular GPS 700MHz ~ 2.2GHz 161-TFLGA Module; MF: Nordic Semiconductor ASA; Purchase-URL: https://pricing.snapeda.com/search/part/NRF9160-SICA-R7/?ref=eda; Availability: Good; Price: None; Package: Module Nordic Semiconductor ASA; Value: *; SnapEDA_Link: https://www.snapeda.com/parts/NRF9160-SICA-R7/Nordic%20Semiconductor%20ASA/view-part/3660917/?ref=snap; MP: NRF9160-SICA-R7
IC1202 = PCAL6408APWJ: Integrated Circuit; Manufacturer_Name: NXP; Datasheet Link: http://www.nxp.com/docs/en/data-sheet/PCAL6408A.pdf; Height: 1.1mm; Manufacturer_Part_Number: PCAL6408APWJ; Mouser Part Number: 771-PCAL6408APWJ; Mouser Price/Stock: https://www.mouser.co.uk/ProductDetail/NXP-Semiconductors/PCAL6408APWJ?qs=1sbE9T7hb3ayrs2xEWMTlg%3D%3D; Arrow Part Number: PCAL6408APWJ; Arrow Price/Stock: https://www.arrow.com/en/products/pcal6408apwj/nxp-semiconductors
L1201 L1202 = L
PB1201 PB1202 = PTS645SM43SMTR92LFS: Switch 4-pi. used 1-3 (2-4 not in use); Manufacturer_Name: C & K COMPONENTS; Manufacturer_Part_Number: TLS A 070J LFS; Description_: Tactile Switches Top actuated tact, 0.9 mm travel, 7 N, 50% Tactile, J Leads, SMT, 8.6 x 8.4 x 3.95 mm, Soft Actuator; Footprint: TLSA070JLFS; Supplier: https://www.mouser.ph/datasheet/2/60/tls-1846606.pdf; Mouser Part Number: 611-TLSA070JLFS; Mouser Price/Stock: https://www.mouser.co.uk/ProductDetail/CK/TLS-A-070J-LFS?qs=GedFDFLaBXEdAqJ422mDcw%3D%3D
R1201-R1206 R1209-R1217 = R
  R1202 R1203: Value: 4.7k
TP1201-TP1203 TP1206 TP1212-TP1214 = TP

## Nets that join several sheets
+BATT: cSLIM-SA_connectors (J501.1 J515.3 TP505.1), cSLIM-SA_power (6 pins)
GND: cSLIM-SA-LoRa (22 pins), cSLIM-SA_RS485 (C301.2 IC301.5 IC302.5 J302.1), cSLIM-SA_RS232 (5 pins), cSLIM-SA_connectors (34 pins), cSLIM-SA_power (20 pins), cSLIM-SA_uSD (IC701.10), cSLIM-SA_display (7 pins), cSLIM-SA_GPS (21 pins), cSLIM-SA_FRAM (C1001.2 IC1001.4), cSLIM-SA_RTC (R1101.2 R1102.1 Y1101.5), cSLIM-SA_nRF9160 (64 pins)
nRF_VDD_GPIO: cSLIM-SA_GPS (C903.2 C904.2 IC904.3), cSLIM-SA_nRF9160 (IC1201.12 NT1202.1 TP1203.1)
SIM_1V8: cSLIM-SA_connectors (C502.1 J513.C1 TP501.1), cSLIM-SA_nRF9160 (C1215.1 D1201.A4 IC1201.49)
VDD: cSLIM-SA-LoRa (5 pins), cSLIM-SA_RS485 (C301.1 IC301.8 IC302.8 J301.2), cSLIM-SA_RS232 (C405.1 IC401.15), cSLIM-SA_connectors (10 pins), cSLIM-SA_power (5 pins), cSLIM-SA_uSD (5 pins), cSLIM-SA_display (5 pins), cSLIM-SA_GPS (5 pins), cSLIM-SA_FRAM (C1001.1 IC1001.3 IC1001.7 IC1001.8), cSLIM-SA_RTC (R1103.2 Y1101.6), cSLIM-SA_nRF9160 (20 pins)
Battery_voltage: cSLIM-SA_power (C602.1 R601.1 R603.1), cSLIM-SA_nRF9160 (IC1201.23)
GPIO_BUS_P0: cSLIM-SA_connectors (J516.2), cSLIM-SA_nRF9160 (IC1202.4)
GPIO_BUS_P1: cSLIM-SA_connectors (J516.3), cSLIM-SA_nRF9160 (IC1202.5)
GPIO_BUS_P2: cSLIM-SA_connectors (J516.4), cSLIM-SA_nRF9160 (IC1202.6)
GPS_ANTENNA_EXT: cSLIM-SA_connectors (J507.1), cSLIM-SA_GPS (R908.1)
GPS_ANTENNA_nRF: cSLIM-SA_connectors (J514.1), cSLIM-SA_GPS (IC904.5)
GPS_EXTINT: cSLIM-SA_GPS (R907.2), cSLIM-SA_nRF9160 (IC1201.97)
GPS_nEnable: cSLIM-SA_GPS (IC903.1 R903.1), cSLIM-SA_nRF9160 (IC1201.20)
GPS_TIMEPULSE: cSLIM-SA_RTC (R1102.2 TP1101.1 Y1101.4), cSLIM-SA_nRF9160 (R1216.2 R1217.2)
I2C_SCL: cSLIM-SA_connectors (J502.2), cSLIM-SA_RTC (Y1101.8), cSLIM-SA_nRF9160 (IC1201.89 IC1202.14 R1203.1 TP1213.1)
I2C_SDA: cSLIM-SA_connectors (J502.3), cSLIM-SA_RTC (Y1101.2), cSLIM-SA_nRF9160 (IC1201.88 IC1202.15 R1202.1 TP1212.1)
LoRa_EXTINT: cSLIM-SA-LoRa (IC202.5), cSLIM-SA_nRF9160 (IC1201.37)
LoRa_nEnable: cSLIM-SA-LoRa (IC203.1 R203.1), cSLIM-SA_nRF9160 (IC1201.2)
LoRa_SWDCLK: cSLIM-SA-LoRa (IC201.30), cSLIM-SA_connectors (J508.4)
LoRa_SWDIO: cSLIM-SA-LoRa (IC201.29), cSLIM-SA_connectors (J508.2)
NEO_Timepulse: cSLIM-SA_GPS (IC901.3), cSLIM-SA_nRF9160 (IC1201.84 R1216.1)
nINT_RTC: cSLIM-SA_RTC (R1103.1 Y1101.3), cSLIM-SA_nRF9160 (IC1201.86)
nLED_BLUE1: cSLIM-SA_connectors (LED504.1), cSLIM-SA_nRF9160 (IC1202.11 R1212.2)
nLED_BLUE2: cSLIM-SA_connectors (LED505.1), cSLIM-SA_nRF9160 (IC1202.12 R1213.2)
nLED_GREEN: cSLIM-SA_connectors (LED503.1), cSLIM-SA_nRF9160 (IC1202.9 R1210.2)
nLED_RED: cSLIM-SA_connectors (LED501.1), cSLIM-SA_nRF9160 (IC1202.7 R1209.2)
nLED_YELLOW: cSLIM-SA_connectors (LED502.1), cSLIM-SA_nRF9160 (IC1202.10 R1211.2)
nRESET: cSLIM-SA-LoRa (IC201.25), cSLIM-SA_connectors (J508.10 J512.10), cSLIM-SA_power (C603.1 R605.1 TP605.1), cSLIM-SA_GPS (IC901.8), cSLIM-SA_nRF9160 (IC1201.32 IC1202.3)
nRF_DISPLAY_CS: cSLIM-SA_display (J802.3 TP801.1), cSLIM-SA_nRF9160 (IC1201.38)
nRF_EXT_CS: cSLIM-SA_connectors (J503.2), cSLIM-SA_nRF9160 (IC1201.35)
nRF_FRAM_nCS: cSLIM-SA_FRAM (IC1001.1 TP1001.1), cSLIM-SA_nRF9160 (IC1201.42)
nRF_GPS_EN: cSLIM-SA_GPS (C905.2 C906.2 IC904.2 R909.1), cSLIM-SA_nRF9160 (IC1201.93)
nRF_GPS_LNA: cSLIM-SA_GPS (IC904.10), cSLIM-SA_nRF9160 (IC1201.67)
nRF_GPS_nCS: cSLIM-SA_GPS (5 pins), cSLIM-SA_nRF9160 (IC1201.18)
nRF_LoRa_nCS: cSLIM-SA-LoRa (5 pins), cSLIM-SA_nRF9160 (IC1201.87)
nRF_RX: cSLIM-SA_RS232 (IC401.9), cSLIM-SA_nRF9160 (IC1201.39)
nRF_SWDCLK: cSLIM-SA_connectors (J512.4), cSLIM-SA_nRF9160 (IC1201.33)
nRF_SWDIO: cSLIM-SA_connectors (J512.2), cSLIM-SA_nRF9160 (IC1201.34)
nRF_TX: cSLIM-SA_RS232 (IC401.11), cSLIM-SA_nRF9160 (IC1201.40)
nRF_uSD_nCS: cSLIM-SA_uSD (IC701.1 IC701.6 IC701.9 R701.1), cSLIM-SA_nRF9160 (IC1201.4)
RS232_nShutdown: cSLIM-SA_RS232 (IC401.12 IC401.16), cSLIM-SA_nRF9160 (IC1201.19)
RS232_RX: cSLIM-SA_RS232 (IC401.8), cSLIM-SA_connectors (J510.4)
RS232_TX: cSLIM-SA_RS232 (IC401.13), cSLIM-SA_connectors (J510.3)
RS485_A: cSLIM-SA_RS485 (5 pins), cSLIM-SA_connectors (J509.2)
RS485_B: cSLIM-SA_RS485 (5 pins), cSLIM-SA_connectors (J509.3)
RS485_DE: cSLIM-SA_RS485 (IC301.3 IC302.3), cSLIM-SA_nRF9160 (IC1201.25)
RS485_DI: cSLIM-SA_RS485 (IC301.4 IC302.4), cSLIM-SA_nRF9160 (IC1201.96)
RS485_RE: cSLIM-SA_RS485 (IC301.2 IC302.2), cSLIM-SA_nRF9160 (IC1201.24)
RS485_RX: cSLIM-SA_RS485 (IC301.1 IC302.1), cSLIM-SA_nRF9160 (IC1201.95)
RTC_Clockout: cSLIM-SA_RTC (Y1101.7), cSLIM-SA_nRF9160 (IC1201.83)
SIM_CLK: cSLIM-SA_connectors (J513.C3), cSLIM-SA_nRF9160 (D1201.A2 R1205.2)
SIM_IO: cSLIM-SA_connectors (J513.C7), cSLIM-SA_nRF9160 (D1201.A3 R1206.2)
SIM_RST: cSLIM-SA_connectors (J513.C2), cSLIM-SA_nRF9160 (D1201.A1 R1204.2)
SPI_MISO: cSLIM-SA_connectors (J503.4), cSLIM-SA_uSD (IC701.3), cSLIM-SA_GPS (IC902.4), cSLIM-SA_FRAM (R1001.1), cSLIM-SA_nRF9160 (IC1201.28)
SPI_MOSI: cSLIM-SA_connectors (J503.5), cSLIM-SA_uSD (IC701.5), cSLIM-SA_display (J802.2), cSLIM-SA_GPS (IC902.3), cSLIM-SA_FRAM (R1003.1), cSLIM-SA_nRF9160 (IC1201.29)
SPI_SCK: cSLIM-SA_connectors (J503.3), cSLIM-SA_uSD (IC701.4), cSLIM-SA_display (J802.1), cSLIM-SA_GPS (IC902.5), cSLIM-SA_FRAM (R1002.1), cSLIM-SA_nRF9160 (IC1201.30)
TBR_PPS: cSLIM-SA_connectors (J509.4 TP502.1), cSLIM-SA_nRF9160 (IC1201.26)
UART_RX: cSLIM-SA-LoRa (IC202.3 TP201.1), cSLIM-SA_nRF9160 (IC1201.15)
UART_TX: cSLIM-SA-LoRa (IC202.4), cSLIM-SA_nRF9160 (IC1201.16)
USB_D_N: cSLIM-SA-LoRa (IC201.22), cSLIM-SA_connectors (R501.2)
USB_D_P: cSLIM-SA-LoRa (IC201.21), cSLIM-SA_connectors (R502.2)
USB_VBUS: cSLIM-SA_connectors (FB501.1), cSLIM-SA_power (C601.1 IC601.3 IC601.8 R602.1)
uSD_MISO: cSLIM-SA_connectors (J506.7), cSLIM-SA_uSD (IC701.14)
uSD_MOSI: cSLIM-SA_connectors (J506.3), cSLIM-SA_uSD (IC701.12)
uSD_nCS: cSLIM-SA_connectors (J506.2), cSLIM-SA_uSD (IC701.11)
uSD_nEnable: cSLIM-SA_uSD (IC702.1 R703.1), cSLIM-SA_nRF9160 (IC1201.3)
uSD_SCK: cSLIM-SA_connectors (J506.5), cSLIM-SA_uSD (IC701.13)
uSD_VDD: cSLIM-SA_connectors (J506.4), cSLIM-SA_uSD (IC701.15 IC702.3)
V_MUX_OUT: cSLIM-SA_connectors (J505.1 J515.1 R511.2), cSLIM-SA_power (IC601.7 TP601.1)
VREG_IN: cSLIM-SA_connectors (J515.2), cSLIM-SA_power (C605.1 R607.2 TP602.1 U601.5)